# Altium schematic sheet LED Driver.SchDoc: LED Driver
size 228 x 165 mm; DrawnBy: Joseph Riesen; Revision: 1.0; SheetNumber: 8; SheetTotal: 10
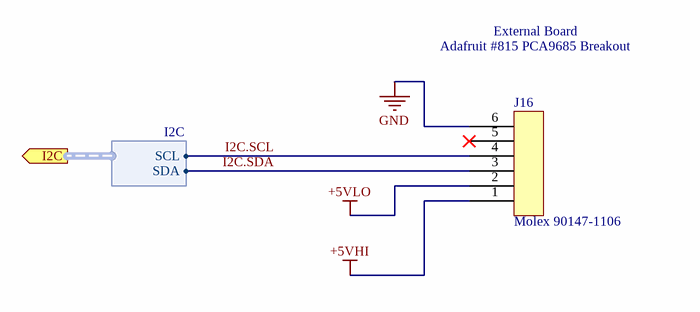
[diagram p0: LED Driver.SchDoc]

## Parts
J16  Molex 90147-1106  [Molex 90147-1106]

## Ports
I2C (out, harness I2C)

## Harnesses
I2C: SCL, SDA

## Nets
+5VHI: J16.1
+5VLO: J16.2
GND: J16.6
I2C.SCL: J16.4 ; port I2C.SCL
I2C.SDA: J16.3 ; port I2C.SDA

Not connected (* = marked no-connect by the designer): J16 5*

## Notes on the sheet
- External Board
  Adafruit #815 PCA9685 Breakout
- Title:
- Size:
- Letter
- Drawn By:
- Rev:
- Date:
- Time:
- Sheet
- /

## Library data of the parts
J16 = Molex 90147-1106 C-Grid 6-Pin Header: C-Grid® PC Board Connector, Single Row, Vertical, 6 Circuits, Tin (Sn) Plating; Number of Contacts: 6; Gender: Receptacle; Current Rating: 3A; Voltage Rating: 350V; Pitch: 2.54mm; Glow Wire Compliant: Non-compliant; Supplier 1: Digi-Key; Manufacturer: Molex; Manufacturer Part Number: 90147-1106; Stock 1: 752; Pricing 1: 1 = 1.94000, 10 = 1.76400, 25 = 1.65600, 50 = 1.58400, 100 = 1.51200, 250 = 1.36800, 500 = 1.26000, 1000 = 1.08000, 2500 = 1.00800 (USD); RoHS 1: Yes; Mount: Through Hole; Contact Plating: Tin; Contact Material: Bronze; Housing Material: Polyester; Material: Bronze; Min Operating Temperature: -55°C; Max Operating Temperature: 125°C; Number of Rows: 1; Termination: Through Hole; Packaging: Rail/Tube; Number of Positions: 6; Orientation: Vertical; Contact Gender: Female; Number of Circuits: 6; Radiation Hardening: No; Flammability Rating: UL94 V-0; ComponentLink1URL: https://datasheet.ciiva.com/30085/0901471106-pcb-receptacles-30085169.pdf?src-supplier=Onlinecomponents.com; ComponentLink1Description: Datasheet 1 (Onlinecomponents.com); ComponentLink2URL: https://datasheet.ciiva.com/5155/0901471106-pcb-receptacles-176766-5155891.pdf?src-supplier=Mouser; ComponentLink2Description: Datasheet 2 (Mouser); ComponentLink3URL: https://datasheet.ciiva.com/10085/0901471106-pcb-receptacles-10085156.pdf?src-supplier=Avnet; ComponentLink3Description: Datasheet 3 (Avnet); Supplier Part Number 1: WM4223-ND